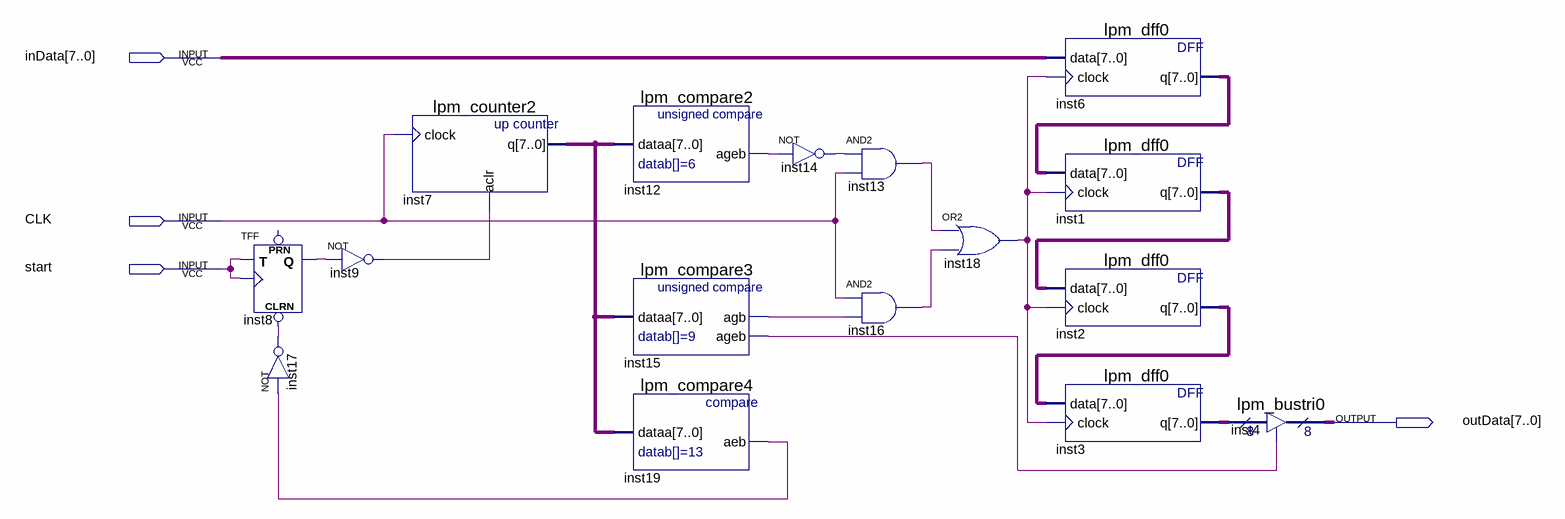
[diagram p0: schematic sheet]
// Quartus schematic buffer.bdf as structural Verilog: 16 symbols, 4 pins
module buffer (
  input  [7:0] inData,
  input  CLK,
  input  start,
  output [7:0] outData
);

  wire inst8_q, inst9_out, inst12_ageb, inst13_out, inst14_out, inst15_agb, inst15_ageb, inst16_out,
       inst17_out, inst18_out, inst19_aeb;
  wire [7:0] inst1_q, inst2_q, inst3_q, inst6_q, inst7_q;

  TFF inst8 (.CLRN(inst17_out), .T(start), .CLK(start), .Q(inst8_q));  // open: PRN
  not inst17 (inst17_out, inst19_aeb);
  not inst9 (inst9_out, inst8_q);
  lpm_counter2 inst7 (.clock(CLK), .aclr(inst9_out), .q(inst7_q));
  lpm_compare2 inst12 (.dataa(inst7_q), .ageb(inst12_ageb));
  lpm_compare3 inst15 (.dataa(inst7_q), .agb(inst15_agb), .ageb(inst15_ageb));
  lpm_compare4 inst19 (.dataa(inst7_q), .aeb(inst19_aeb));
  and inst13 (inst13_out, inst14_out, CLK);
  not inst14 (inst14_out, inst12_ageb);
  and inst16 (inst16_out, CLK, inst15_agb);
  or inst18 (inst18_out, inst13_out, inst16_out);
  lpm_dff0 inst6 (.data(inData), .clock(inst18_out), .q(inst6_q));
  lpm_dff0 inst1 (.data(inst6_q), .clock(inst18_out), .q(inst1_q));
  lpm_dff0 inst2 (.data(inst1_q), .clock(inst18_out), .q(inst2_q));
  lpm_dff0 inst3 (.data(inst2_q), .clock(inst18_out), .q(inst3_q));
  lpm_bustri0 inst4 (.enabledt(inst15_ageb), .data(inst3_q), .tridata(outData));
endmodule
